# Altium schematic sheet 01_MAIN.SchDoc: =GlobalProjectName
size 594 x 420 mm; CheckedBy: A_D; Author: A_D; SheetTotal: 1; PageSetup: Record=PageOptions|CenterHorizontal=True|CenterVertical=True|PrintScale=0.70|XCorrection=1.00|YCorrection=1.00|PrintKind=2|BorderSize=5000000|LeftOffset=9000|BottomOffset=10100|Orientation=2|PaperLength=11176|PaperWidth=8636|Scale=100|PaperSource=259|PrintQuality=-3|MediaType=1|DitherType=10|PrintScaleMode=1|PaperKind=A3|PaperIndex=8
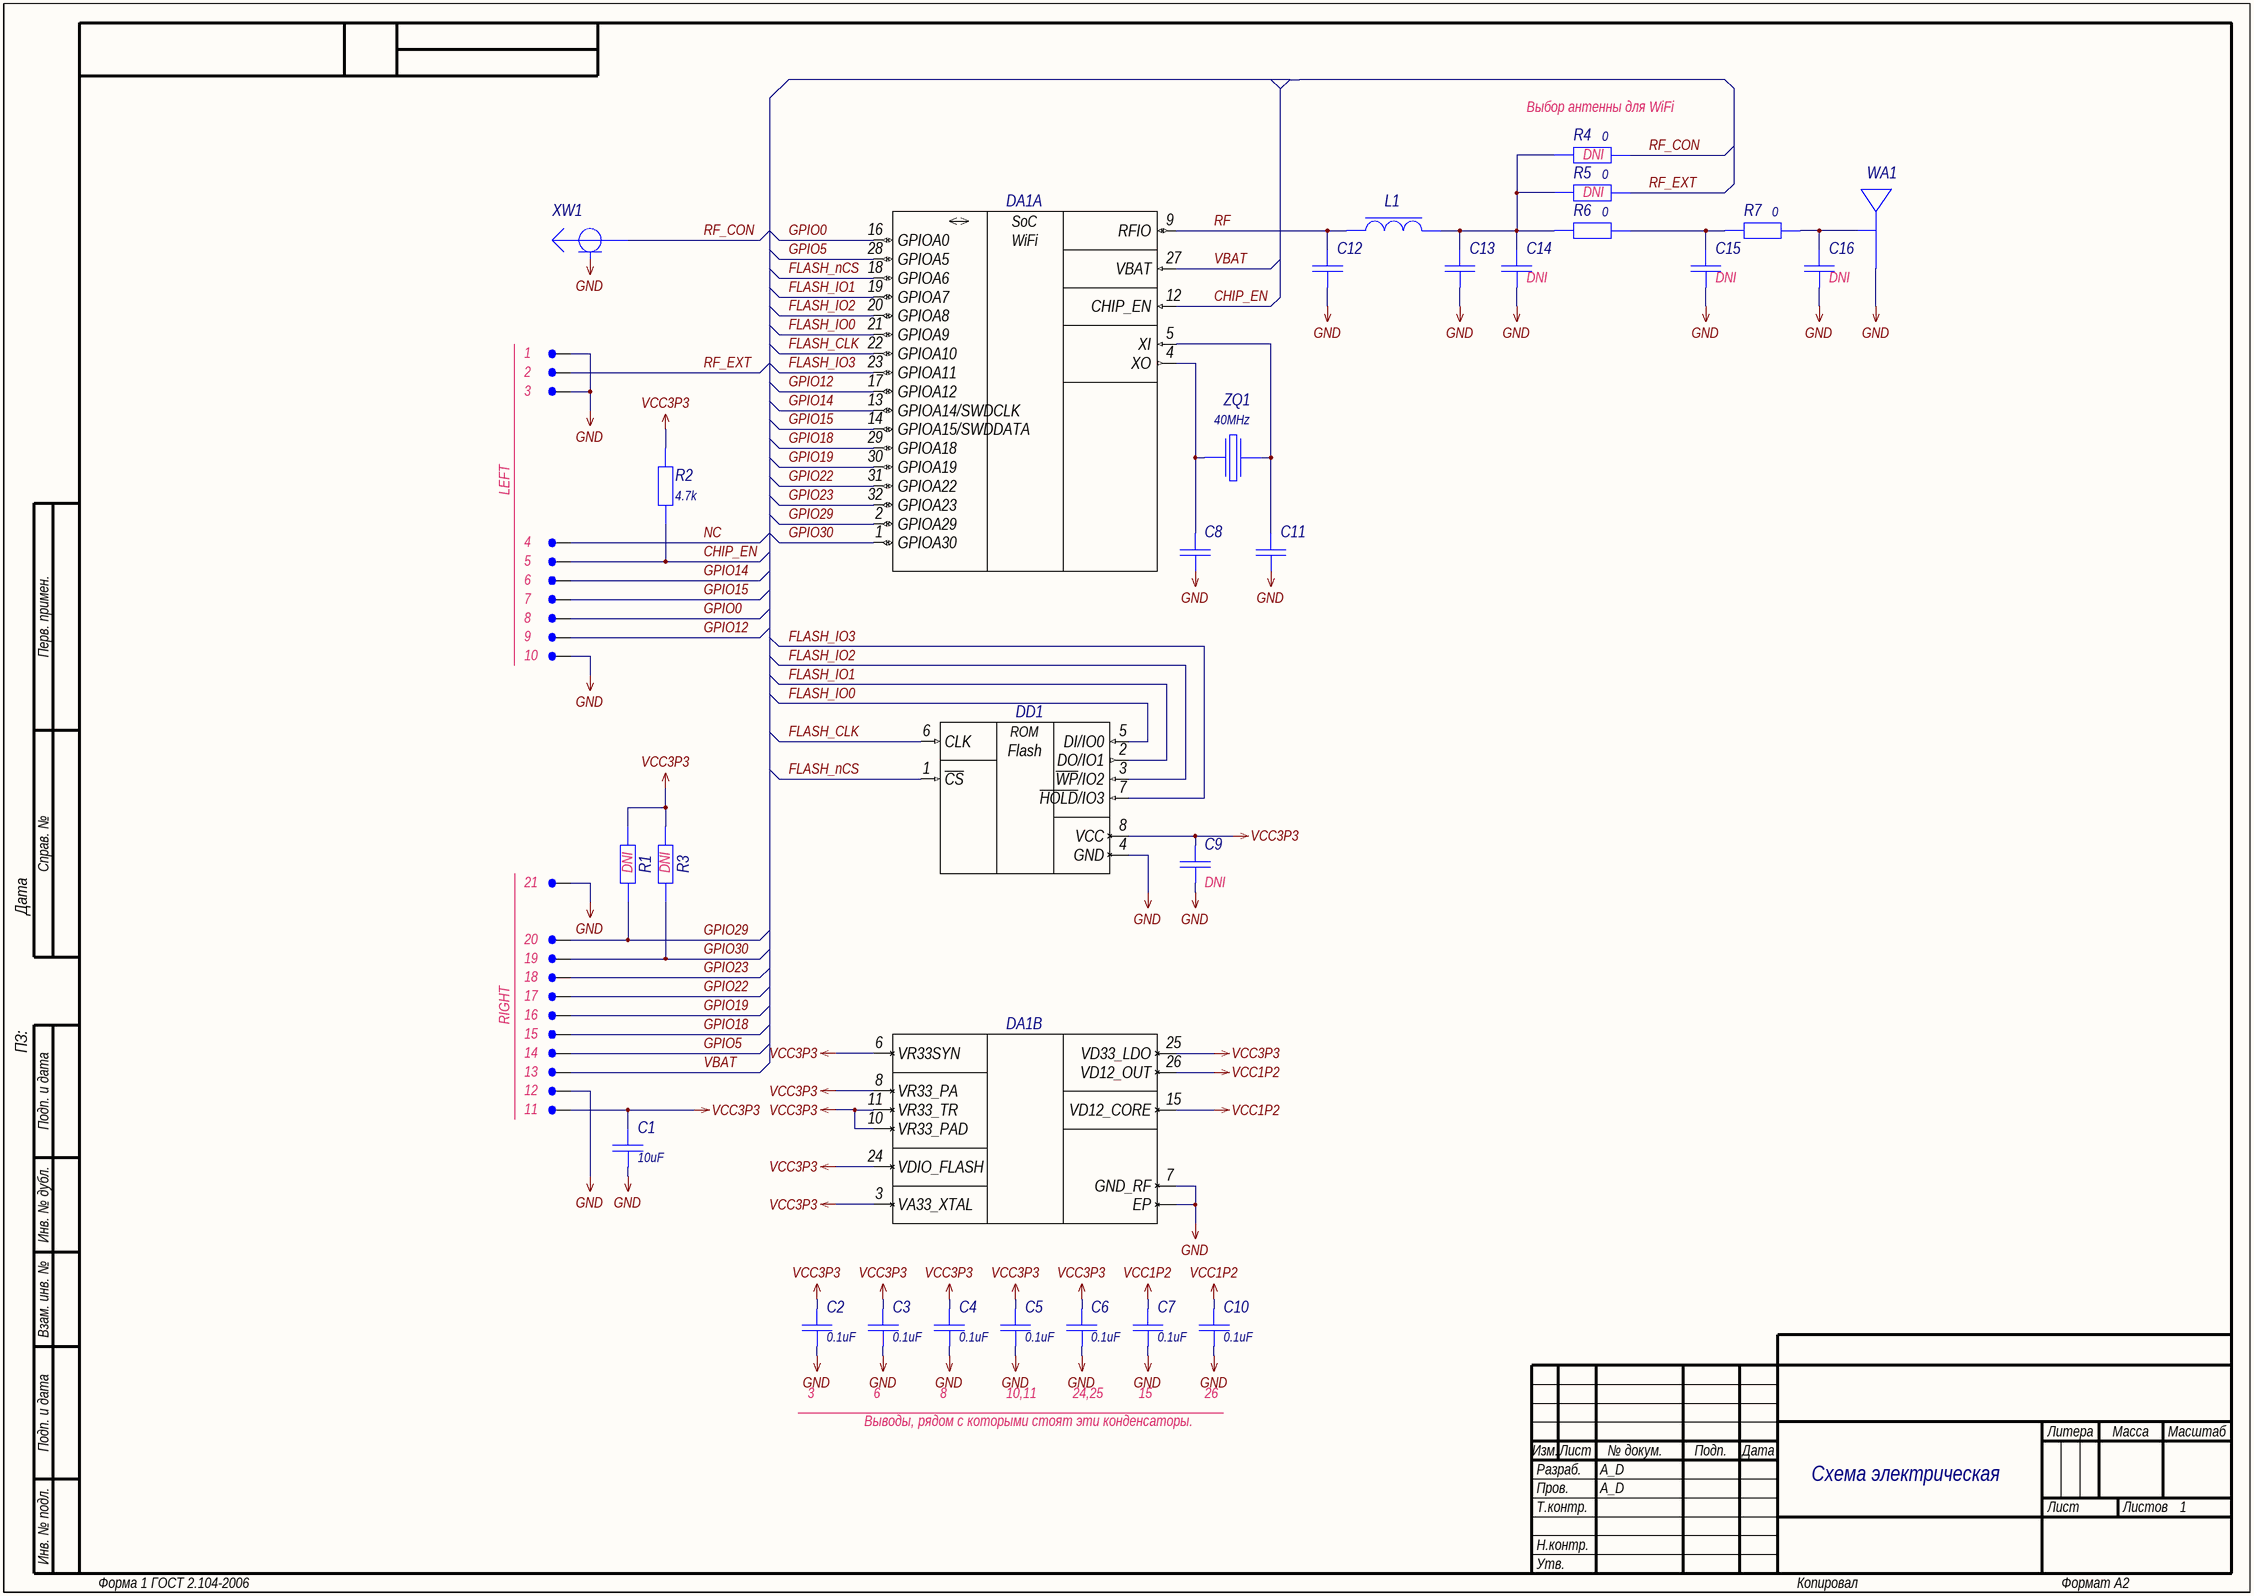
[diagram p0: 01_MAIN.SchDoc]

## Parts
C1  value 10uF  [C0603_L]  (hidden comment: Capacitor)
C2  value 0.1uF  [C0402_L]  (hidden comment: Capacitor)
C3  value 0.1uF  [C0402_L]  (hidden comment: Capacitor)
C4  value 0.1uF  [C0402_L]  (hidden comment: Capacitor)
C5  value 0.1uF  [C0402_L]  (hidden comment: Capacitor)
C6  value 0.1uF  [C0402_L]  (hidden comment: Capacitor)
C7  value 0.1uF  [C0402_L]  (hidden comment: Capacitor)
C8  Capacitor  [C0402_L]  (value not drawn)
C9  Capacitor  [C0402_L]  (value not drawn)  (no BOM)
C10  value 0.1uF  [C0402_L]  (hidden comment: Capacitor)
C11  Capacitor  [C0402_L]  (value not drawn)
C12  Capacitor  [C0402_L]  (value not drawn)
C13  Capacitor  [C0402_L]  (value not drawn)
C14  Capacitor  [C0402_L]  (value not drawn)  (no BOM)
C15  Capacitor  [C0402_L]  (value not drawn)  (no BOM)
C16  Capacitor  [C0402_L]  (value not drawn)  (no BOM)
DA1  RTL8710BN  [QFN-32]  (value not drawn)  (parts A,B of 2)
DD1  W25Q-Series  [SOIC-8]  (value not drawn)
L1  Coil  [L0402_L]  (value not drawn)
R1  Resistor  [R0402_L]  (value not drawn)  (no BOM)
R2  value 4.7k  [R0402_L]  (hidden comment: Resistor)
R3  Resistor  [R0402_L]  (value not drawn)  (no BOM)
R4  value 0  [R0402_L]  (hidden comment: Resistor)  (no BOM)
R5  value 0  [R0402_L]  (hidden comment: Resistor)  (no BOM)
R6  value 0  [R0402_L]  (hidden comment: Resistor)
R7  value 0  [R0402_L]  (hidden comment: Resistor)
WA1  Antenna_PCB_2p  [PCB-AN043]  (value not drawn)  (net tie, no BOM)
XS1  PCB-SPIN  [PCB-SPIN]  (value not drawn)  (no BOM)
XS2  PCB-SPIN  [PCB-SPIN]  (value not drawn)  (no BOM)
XS3  PCB-SPIN  [PCB-SPIN]  (value not drawn)  (no BOM)
XS4  PCB-SPIN  [PCB-SPIN]  (value not drawn)  (no BOM)
XS5  PCB-SPIN  [PCB-SPIN]  (value not drawn)  (no BOM)
XS6  PCB-SPIN  [PCB-SPIN]  (value not drawn)  (no BOM)
XS7  PCB-SPIN  [PCB-SPIN]  (value not drawn)  (no BOM)
XS8  PCB-SPIN  [PCB-SPIN]  (value not drawn)  (no BOM)
XS9  PCB-SPIN  [PCB-SPIN]  (value not drawn)  (no BOM)
XS10  PCB-SPIN  [PCB-SPIN]  (value not drawn)  (no BOM)
XS11  PCB-SPIN  [PCB-SPIN]  (value not drawn)  (no BOM)
XS12  PCB-SPIN  [PCB-SPIN]  (value not drawn)  (no BOM)
XS13  PCB-SPIN  [PCB-SPIN]  (value not drawn)  (no BOM)
XS14  PCB-SPIN  [PCB-SPIN]  (value not drawn)  (no BOM)
XS15  PCB-SPIN  [PCB-SPIN]  (value not drawn)  (no BOM)
XS16  PCB-SPIN  [PCB-SPIN]  (value not drawn)  (no BOM)
XS17  PCB-SPIN  [PCB-SPIN]  (value not drawn)  (no BOM)
XS18  PCB-SPIN  [PCB-SPIN]  (value not drawn)  (no BOM)
XS19  PCB-SPIN  [PCB-SPIN]  (value not drawn)  (no BOM)
XS20  PCB-SPIN  [PCB-SPIN]  (value not drawn)  (no BOM)
XS21  PCB-SPIN  [PCB-SPIN]  (value not drawn)  (no BOM)
XW1  Con-RF-M  [1909763-1]  (value not drawn)
ZQ1  Output Frequency: 40MHz  [SX-2520]  (hidden comment: Crystal)

## Nets
GND: C1.1 C2.1 C3.1 C4.1 C5.1 C6.1 C7.1 C8.1 C9.1 C10.1 C11.1 C12.1 C13.1 C14.1 C15.1 C16.1 DA1.7(GND_RF) DA1.33(EP) DD1.4(GND) WA1.2 XS1.1 XS3.1 XS10.1 XS11.1 XS20.1 XW1.2
VCC1P2: C7.2 C10.2 DA1.15(VD12_CORE) DA1.26(VD12_OUT)
VCC3P3: C1.2 C2.2 C3.2 C4.2 C5.2 C6.2 C9.2 DA1.3(VA33_XTAL) DA1.6(VR33SYN) DA1.8(VR33_PA) DA1.10(VR33_PAD) DA1.11(VR33_TR) DA1.24(VDIO_FLASH) DA1.25(VD33_LDO) DD1.8(VCC) R1.2 R2.2 R3.2 XS21.1
CHIP_EN: DA1.12(CHIP_EN) R2.1 XS5.1
FLASH_CLK: DA1.22(GPIOA10) DD1.6(CLK)
FLASH_IO0: DA1.21(GPIOA9) DD1.5(DI/IO0)
FLASH_IO1: DA1.19(GPIOA7) DD1.2(DO/IO1)
FLASH_IO2: DA1.20(GPIOA8) DD1.3(~{WP}/IO2)
FLASH_IO3: DA1.23(GPIOA11) DD1.7(~{HOLD}/IO3)
FLASH_nCS: DA1.18(GPIOA6) DD1.1(~{CS})
GPIO0: DA1.16(GPIOA0) XS8.1
GPIO5: DA1.28(GPIOA5) XS18.1
GPIO12: DA1.17(GPIOA12) XS9.1
GPIO14: DA1.13(GPIOA14/SWDCLK) XS6.1
GPIO15: DA1.14(GPIOA15/SWDDATA) XS7.1
GPIO18: DA1.29(GPIOA18) XS17.1
GPIO19: DA1.30(GPIOA19) XS16.1
GPIO22: DA1.31(GPIOA22) XS15.1
GPIO23: DA1.32(GPIOA23) XS14.1
GPIO29: DA1.2(GPIOA29) R1.1 XS12.1
GPIO30: DA1.1(GPIOA30) R3.1 XS13.1
NC: XS4.1
RF: C12.2 DA1.9(RFIO) L1.1
RF_CON: R4.2 XW1.1
RF_EXT: R5.2 XS2.1
VBAT: DA1.27(VBAT) XS19.1
NetC8_2: C8.2 DA1.4(XO) ZQ1.1
NetC11_2: C11.2 DA1.5(XI) ZQ1.3
NetC13_2: C13.2 C14.2 L1.2 R4.1 R5.1 R6.1
NetC15_2: C15.2 R6.2 R7.1
NetC16_2: C16.2 R7.2 WA1.1

## Notes on the sheet
- (near R4) Выбор антенны для WiFi
- (near R4) DNI
- (near R5) DNI
- (near C14) DNI
- (near C15) DNI
- (near C16) DNI
- 1
- 2
- 3
- LEFT
- 4
- 5
- 6
- 7
- 8
- 9
- 10
- (near XS11) 21
- (near R1) DNI
- (near R3) DNI
- (near C9) DNI
- 18
- 19
- 20
- RIGHT
- 16
- 17
- 13
- 14
- 15
- 11
- 12
- 10,11
- 24,25
- 26
- Выводы, рядом с которыми стоят эти конденсаторы.
- Схема электрическая
  принципиальная
- Перв. примен.
- Справ. №
- ПЗ:                             Дата
- Подп. и дата
- Инв. № дубл.
- Взам. инв. №
- Разраб.
- Изм.
- Лист
- № докум.
- Подп.
- Дата
- Литера
- Масса
- Масштаб
- Пров.
- Т.контр.
- Листов
- Инв. № подл.
- Н.контр.
- Утв.
- Форма 1 ГОСТ 2.104-2006
- Копировал
- Формат А2
- (in symbol RTL8710BN, part A) SoC; WiFi
- (in symbol W25Q16DVSNIG) ROM; Flash

## Library data of the parts
C1 = GRM188R61A106KE69D: Manufacturer: Murata; Type: Конденсатор; ID: 173; Voltage: 10V; Tolerance: ±10%; Dielectric Type: X5R; Application Category: 1; Working Temperature Min: -55°С; Working Temperature Max: +85°С; Published: 18.05.2010; Publisher: Andrew Danich; Part Number: GRM188R61A106KE69D; Footprint: 0603
C2-C7 C10 = GRM155R71C104KA88D: Manufacturer: Murata; Type: Конденсатор; ID: 163; Voltage: 16V; Tolerance: ±10%; Dielectric Type: X7R; Published: 18.05.2010; Publisher: Andrew Danich; Part Number: GRM155R71C104KA88D; Footprint: 0402
C8 C11 = GRM1555C1H4R0CZ01D: Manufacturer: Murata; Type: Конденсатор; ID: 197; Value: 4pF; Voltage: 50V; Tolerance: ±0.25pF; Dielectric Type: NP0; Application Category: 1; Working Temperature Min: -55°С; Working Temperature Max: +125°С; Published: 18.05.2010; Publisher: Andrew Danich; Part Number: GRM1555C1H4R0CZ01D; Footprint: 0402
C9 = GRM155R71C104KA88D: Manufacturer: Murata; Type: Конденсатор; ID: 163; Value: 0.1uF; Voltage: 16V; Tolerance: ±10%; Dielectric Type: X7R; Published: 18.05.2010; Publisher: Andrew Danich; Part Number: GRM155R71C104KA88D; Footprint: 0402
C12-C16 = GRM1555C1H100JA01D: Manufacturer: Murata; Type: Конденсатор; ID: 194; Value: 10pF; Voltage: 50V; Tolerance: ±5%; Dielectric Type: NP0; Application Category: 1; Working Temperature Min: -55°С; Working Temperature Max: +125°С; Published: 18.05.2010; Publisher: Andrew Danich; Part Number: GRM1555C1H100JA01D; Footprint: 0402
DA1 = RTL8710BN: Manufacturer: Realtek; ID: 4; Supply Operation: +3.0…3.6V; Supply Current: 150mA; Flash: External; Wireless Compatibility: WiFi 802.11 b/g/n, 802.11e; Supported Interfaces: SDIO, I2C, PWM, SPI, UART, RTC, ADC; I/O Lines: 17; Operation Frequency: 125MHz; Application Category: 1; Working Temperature Min: -20°С; Working Temperature Max: +85°С; Published: 05.06.2017; Publisher: Andrew Danich; Type: Микросхема; Part Number: RTL8710BN; Value: RTL8710BN; Functional Analog: -
DD1 = W25Q16DVSNIG: Manufacturer: Winbond; ID: 10; Supply Operation: +2.7…3.6V; Supply Current: 4mA; Memory: 16Mbit/2Mbyte; Addressable: NO; Interface: SPI, Dual SPI, Quad SPI; Clock Frequency: 104/208/416MHz; Application Category: 1; Working Temperature Min: -40°С; Working Temperature Max: +85°С; Published: 11.06.2017; Type: Микросхема; Publisher: Andrew Danich; Part Number: W25Q16DVSNIG; Value: W25Q16DVSNIG
L1 = LQG15HS2N2S02D: Manufacturer: Murata; Type: Дроссель; ID: 84; Rated Current: 300mA; Tolerance: ±0.3nH; Inductance: 2.2nH; Application Category: 1; Published: 20.05.2010; Publisher: Andrew Danich; Part Number: LQG15HS2N2S02D; Value: LQG15HS2N2S02D; Footprint: 0402
R1 R3 = RC0402JR-074K7L: Manufacturer: Yageo; ID: 4; Value: 4.7k; Limit Voltage: 50V; Tolerance: ±5%; Temperature Coefficient: 100ppm; Total Power Dissipation: 0.1W; Series Type: Thick-Film; Application Category: 1; Working Temperature Min: -55°С; Working Temperature Max: +155°С; Published: 24.03.2010; Publisher: Andrew Danich; Type: Резистор; Part Number: RC0402JR-074K7L; Footprint: 0402
R2 = RC0402JR-074K7L: Manufacturer: Yageo; ID: 4; Limit Voltage: 50V; Tolerance: ±5%; Temperature Coefficient: 100ppm; Total Power Dissipation: 0.1W; Series Type: Thick-Film; Application Category: 1; Working Temperature Min: -55°С; Working Temperature Max: +155°С; Published: 24.03.2010; Publisher: Andrew Danich; Type: Резистор; Part Number: RC0402JR-074K7L; Footprint: 0402
R4-R7 = RC0402JR-070RL: Manufacturer: Yageo; ID: 362; Limit Voltage: 50V; Tolerance: ±1%; Temperature Coefficient: 100ppm; Total Power Dissipation: 0.1W; Series Type: Thick-Film; Application Category: 1; Working Temperature Min: -55°С; Working Temperature Max: +155°С; Published: 24.03.2010; Publisher: Andrew Danich; Type: Резистор; Part Number: RC0402JR-070RL; Footprint: 0402
WA1 = PCB-AN043: Manufacturer: Texas Instruments; ID: 2; Center Frequency: 2.45GHz; Input Impedance: 50ohm; Application Category: 1; Published: 08.01.2017; Type: Антенна; Publisher: Andrew Danich; Part Number: PCB-AN043; Value: PCB-AN043; Functional Analog: -
XW1 = 1909763-1: Manufacturer: TE Connectivity; ID: 3; Connector Type: Male; Wave Resistance: 50ohm; Surface Finish: Gold; Frequency Band: 6GHz; Application Category: 1; Working Temperature Min: -40°С; Working Temperature Max: +90°С; Published: 19.09.2015; Publisher: НТЦ "Вектор"; Type: Вилка; Part Number: 1909763-1; Value: 1909763-1; Limit Voltage: -; Limit Current: -; Pins: 3
ZQ1 = CX2520DB40000D0FLJCC: Manufacturer: AVX / Kyocera; ID: 24; Load Capacitance: 8pF; Temperature Coefficient: ±15ppm; Application Category: 1; Working Temperature Min: -30°С; Working Temperature Max: +85°С; Drive Level: 10uW; Published: 08.03.2013; Publisher: Andrew Danich; Type: Резонатор; Part Number: CX2520DB40000D0FLJCC; Value: CX2520DB40000D0FLJCC